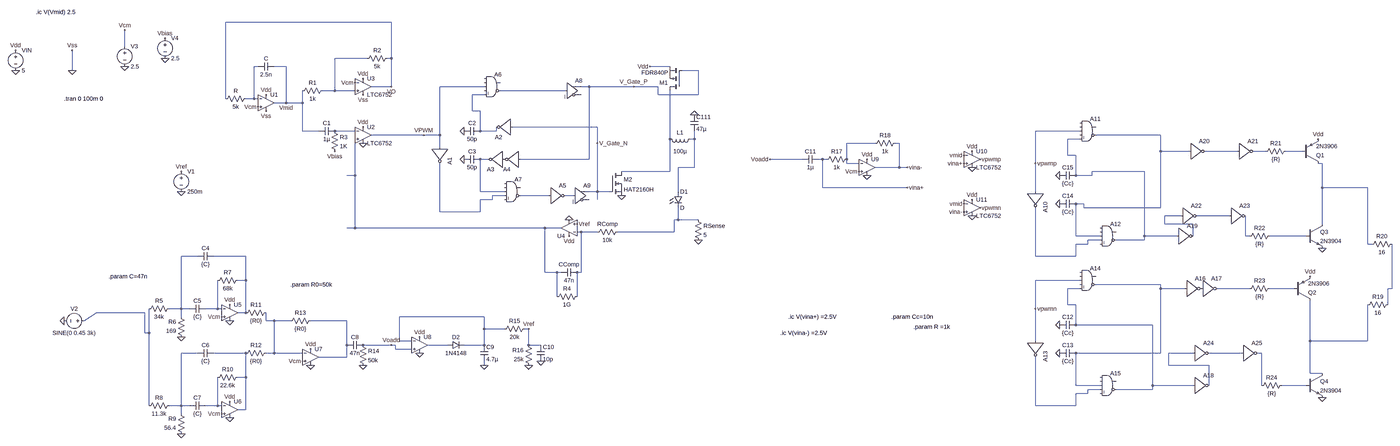
[diagram p0: schematic Final Ckt.asc, whole sheet]
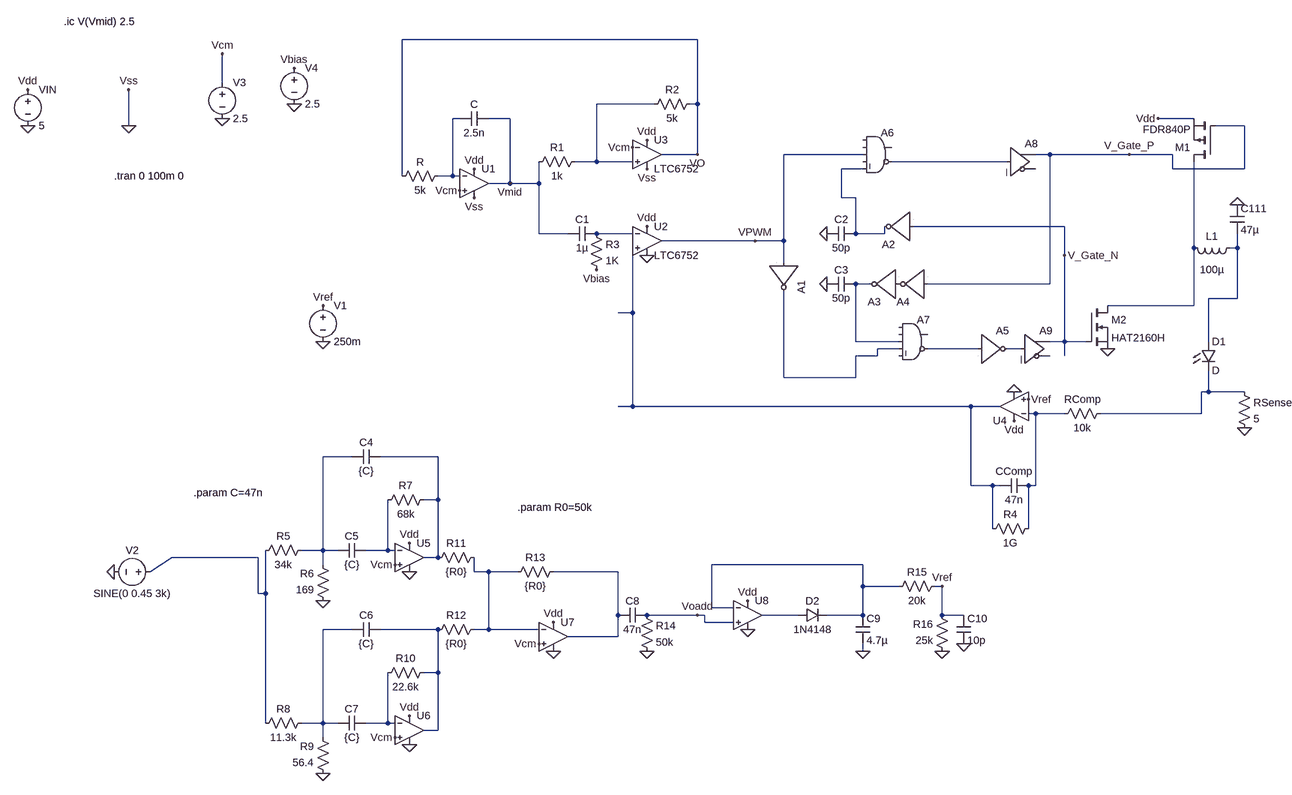
[diagram p1: schematic Final Ckt.asc, part, row 1 of 1, column 1 of 2]
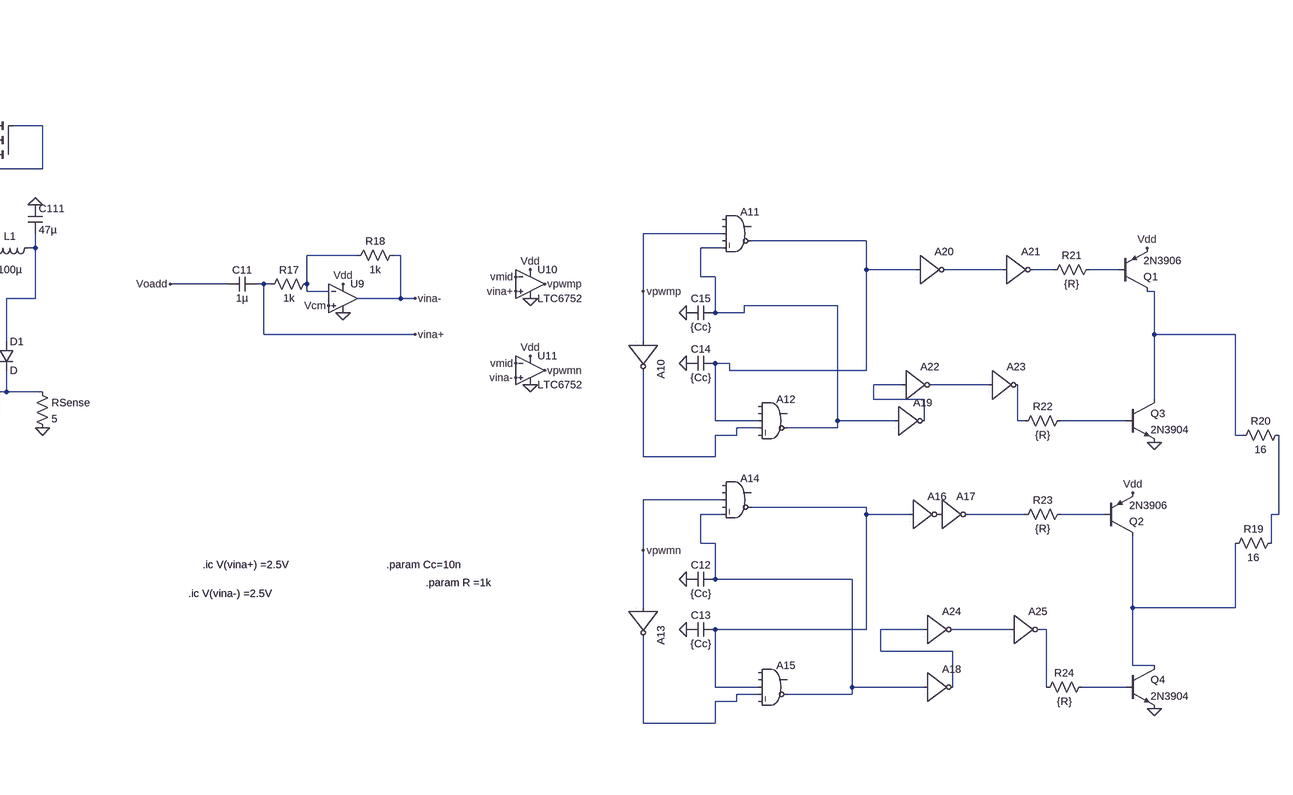
[diagram p2: schematic Final Ckt.asc, part, row 1 of 1, column 2 of 2]
Final Ckt.asc, the LTspice schematic file:
Version 4
SHEET 1 5192 1524
WIRE 624 -128 -32 -128
WIRE -432 -32 -432 -96
WIRE 528 16 400 16
WIRE 624 16 624 -128
WIRE 624 16 608 16
WIRE 96 48 80 48
WIRE 208 48 160 48
WIRE 1728 48 1648 48
WIRE -640 64 -640 -16
WIRE 1840 64 1776 64
WIRE 624 128 624 16
WIRE 624 128 544 128
WIRE 992 128 816 128
WIRE 1408 128 1376 128
WIRE 1584 128 1408 128
WIRE 1680 128 1584 128
WIRE 400 144 400 16
WIRE 400 144 352 144
WIRE 480 144 400 144
WIRE 1312 144 1056 144
WIRE 992 160 944 160
WIRE 1680 160 1680 128
WIRE 1840 160 1840 64
WIRE 1840 160 1680 160
WIRE -32 176 -32 -128
WIRE 80 176 80 48
WIRE 80 176 48 176
WIRE 96 176 80 176
WIRE 208 192 208 48
WIRE 208 192 160 192
WIRE 272 192 272 144
WIRE 272 192 208 192
WIRE 944 224 944 160
WIRE 976 224 944 224
WIRE 1440 288 1104 288
WIRE 272 304 272 192
WIRE 336 304 272 304
WIRE 480 304 400 304
WIRE 976 304 976 224
WIRE 1040 304 1040 288
WIRE 1040 304 976 304
WIRE 3936 304 3760 304
WIRE 752 320 544 320
WIRE 816 320 816 128
WIRE 816 320 752 320
WIRE 4256 320 4000 320
WIRE 1728 336 1728 144
WIRE 1824 336 1824 304
WIRE 1824 336 1808 336
WIRE 3936 336 3888 336
WIRE 1440 352 1440 288
WIRE 2960 352 2848 352
WIRE 3056 352 3040 352
WIRE 816 368 816 320
WIRE 4256 384 4256 320
WIRE 4368 384 4256 384
WIRE 4560 384 4432 384
WIRE 4672 384 4624 384
WIRE 4816 384 4752 384
WIRE 3888 400 3888 336
WIRE 3920 400 3888 400
WIRE 1008 416 976 416
WIRE 1408 416 1408 128
WIRE 1408 416 1136 416
WIRE 2672 416 2544 416
WIRE 2752 416 2736 416
WIRE 2768 416 2752 416
WIRE 2848 416 2848 352
WIRE 2848 432 2848 416
WIRE 2896 432 2848 432
WIRE 3760 432 3760 304
WIRE 4896 432 4880 432
WIRE 1824 448 1824 336
WIRE 1824 448 1760 448
WIRE 3056 448 3056 352
WIRE 3056 448 2960 448
WIRE 3088 448 3056 448
WIRE 1728 464 1728 336
WIRE 1728 464 1536 464
WIRE 4192 464 3984 464
WIRE 480 480 480 336
WIRE 480 480 448 480
WIRE 3920 480 3920 400
WIRE 3984 480 3984 464
WIRE 3984 480 3920 480
WIRE 2752 528 2752 416
WIRE 3088 528 2752 528
WIRE 4896 528 4896 432
WIRE 5088 528 4896 528
WIRE 976 544 976 416
WIRE 1072 544 976 544
WIRE 1440 544 1440 352
WIRE 1440 544 1408 544
WIRE 1488 544 1440 544
WIRE 1760 544 1760 448
WIRE 3760 544 3760 432
WIRE 1072 560 1024 560
WIRE 1248 560 1136 560
WIRE 1344 560 1312 560
WIRE 1024 576 1024 560
WIRE 1024 576 976 576
WIRE 1440 576 1440 544
WIRE 3952 592 3920 592
WIRE 3952 608 3952 592
WIRE 4256 608 4256 384
WIRE 4256 608 3952 608
WIRE 816 624 816 432
WIRE 976 624 976 576
WIRE 976 624 816 624
WIRE 4336 640 4272 640
WIRE 4528 640 4400 640
WIRE 1760 656 1760 608
WIRE 1760 656 1744 656
WIRE 1840 656 1760 656
WIRE 4272 672 4272 640
WIRE 4384 672 4272 672
WIRE 4896 672 4896 528
WIRE 480 688 480 480
WIRE 480 688 448 688
WIRE 1232 688 480 688
WIRE 1296 688 1232 688
WIRE 1376 704 1360 704
WIRE 1440 704 1376 704
WIRE 1744 704 1744 656
WIRE 1744 704 1520 704
WIRE 3920 720 3920 592
WIRE 4016 720 3920 720
WIRE 4192 720 4192 464
WIRE 4320 720 4192 720
WIRE 4384 720 4384 672
WIRE 4592 720 4592 640
WIRE 4608 720 4592 720
WIRE 4832 720 4688 720
WIRE 4016 736 3968 736
WIRE 4192 736 4192 720
WIRE 4192 736 4080 736
WIRE 3968 752 3968 736
WIRE 3968 752 3920 752
WIRE 5088 752 5088 528
WIRE 5104 752 5088 752
WIRE -144 800 -208 800
WIRE 48 800 -80 800
WIRE 3760 800 3760 608
WIRE 3920 800 3920 752
WIRE 3920 800 3760 800
WIRE 1232 864 1232 688
WIRE 1280 864 1232 864
WIRE 1296 864 1280 864
WIRE 1376 864 1376 704
WIRE 1376 864 1360 864
WIRE 48 896 48 800
WIRE 48 896 16 896
WIRE 3936 896 3760 896
WIRE 4256 912 4000 912
WIRE 3936 928 3888 928
WIRE 4256 928 4256 912
WIRE 4352 928 4256 928
WIRE 4608 928 4480 928
WIRE 4784 928 4688 928
WIRE 5184 928 5184 752
WIRE 5184 928 5168 928
WIRE 1280 960 1280 864
WIRE 1360 960 1360 864
WIRE 3888 992 3888 928
WIRE 3920 992 3888 992
WIRE 5168 992 5168 928
WIRE -208 1008 -208 800
WIRE -208 1008 -256 1008
WIRE -176 1008 -208 1008
WIRE -64 1008 -64 896
WIRE -64 1008 -112 1008
WIRE -48 1008 -64 1008
WIRE 3760 1008 3760 896
WIRE -352 1024 -544 1024
WIRE 48 1024 48 896
WIRE 48 1024 16 1024
WIRE -208 1040 -208 1008
WIRE 992 1040 656 1040
WIRE -592 1056 -544 1024
WIRE 128 1056 128 1024
WIRE 160 1056 128 1056
WIRE 224 1056 160 1056
WIRE 448 1056 304 1056
WIRE 3920 1072 3920 992
WIRE 4224 1072 3920 1072
WIRE 992 1088 992 1040
WIRE 1072 1088 992 1088
WIRE 1168 1088 1152 1088
WIRE -352 1104 -352 1024
WIRE -336 1104 -336 1008
WIRE -336 1104 -352 1104
WIRE 656 1136 656 1040
WIRE 704 1136 656 1136
WIRE 3760 1136 3760 1008
WIRE 4848 1136 4848 976
WIRE 5088 1136 5088 992
WIRE 5088 1136 4848 1136
WIRE 448 1152 448 1056
WIRE 624 1152 512 1152
WIRE 640 1152 624 1152
WIRE 848 1152 768 1152
WIRE 992 1152 992 1088
WIRE 992 1152 912 1152
WIRE 1168 1152 1168 1088
WIRE 1216 1152 1168 1152
WIRE 640 1168 640 1152
WIRE 704 1168 640 1168
WIRE -144 1184 -208 1184
WIRE 48 1184 -80 1184
WIRE 160 1184 160 1056
WIRE 160 1184 128 1184
WIRE 272 1184 160 1184
WIRE 4256 1184 4256 928
WIRE 4256 1184 3920 1184
WIRE 4384 1184 4288 1184
WIRE 4576 1184 4448 1184
WIRE 4656 1184 4640 1184
WIRE 448 1200 448 1152
WIRE 448 1200 336 1200
WIRE 992 1232 992 1216
WIRE 4288 1232 4288 1184
WIRE 4448 1232 4288 1232
WIRE 4848 1264 4848 1136
WIRE 4896 1264 4848 1264
WIRE 48 1280 48 1184
WIRE 48 1280 16 1280
WIRE 3920 1312 3920 1184
WIRE 4016 1312 3920 1312
WIRE 4224 1312 4224 1072
WIRE 4384 1312 4224 1312
WIRE 4448 1312 4448 1232
WIRE 4656 1312 4656 1184
WIRE 4832 1312 4736 1312
WIRE 4016 1328 3968 1328
WIRE 4224 1328 4224 1312
WIRE 4224 1328 4080 1328
WIRE 3968 1344 3968 1328
WIRE 3968 1344 3920 1344
WIRE -336 1392 -336 1104
WIRE -208 1392 -208 1184
WIRE -208 1392 -256 1392
WIRE -176 1392 -208 1392
WIRE -64 1392 -64 1280
WIRE -64 1392 -112 1392
WIRE -48 1392 -64 1392
WIRE 3760 1392 3760 1200
WIRE 3920 1392 3920 1344
WIRE 3920 1392 3760 1392
WIRE 48 1408 48 1280
WIRE 48 1408 16 1408
WIRE -208 1424 -208 1392
FLAG 128 224 Vss
FLAG 512 160 Vss
FLAG -640 -16 Vss
FLAG 96 208 Vcm
FLAG 480 112 Vcm
FLAG -640 64 0
FLAG -864 64 0
FLAG 624 128 VO
FLAG 208 192 Vmid
FLAG 512 96 Vdd
FLAG 128 160 Vdd
FLAG -864 -16 Vdd
FLAG -432 -96 Vcm
FLAG -432 48 0
FLAG 400 384 Vbias
FLAG -272 -64 Vbias
FLAG -272 16 0
FLAG 512 288 Vdd
FLAG 512 352 0
FLAG 752 320 VPWM
FLAG 912 304 0
FLAG 912 416 0
FLAG 1536 560 0
FLAG 1648 48 Vdd
FLAG 1440 352 V_Gate_N
FLAG 1584 128 V_Gate_P
FLAG 1824 240 0
FLAG 1840 736 0
FLAG 1328 656 0
FLAG 1328 720 Vdd
FLAG 1360 672 Vref
FLAG -208 1120 0
FLAG -16 1056 0
FLAG -48 1040 Vcm
FLAG -16 992 Vdd
FLAG -208 1504 0
FLAG -16 1440 0
FLAG -48 1424 Vcm
FLAG -16 1376 Vdd
FLAG -672 1056 0
FLAG 304 1168 Vdd
FLAG 304 1232 0
FLAG 272 1216 Vcm
FLAG 512 1232 0
FLAG 736 1120 Vdd
FLAG 736 1184 0
FLAG 992 1232 0
FLAG 1216 1216 0
FLAG 1168 1232 0
FLAG 2896 464 Vcm
FLAG 3088 448 vina-
FLAG 3088 528 vina+
FLAG 2928 416 Vdd
FLAG 2928 480 0
FLAG 3344 384 Vdd
FLAG 3344 576 Vdd
FLAG 3344 448 0
FLAG 3344 640 0
FLAG 3312 400 vmid
FLAG 3312 592 vmid
FLAG 3312 624 vina-
FLAG 3312 432 vina+
FLAG 3376 416 vpwmp
FLAG 3376 608 vpwmn
FLAG 3856 480 0
FLAG 3856 592 0
FLAG 3856 1072 0
FLAG 3856 1184 0
FLAG 3760 432 vpwmp
FLAG 3760 1008 vpwmn
FLAG 4848 880 Vdd
FLAG 4880 336 Vdd
FLAG 4896 768 0
FLAG 4896 1360 0
FLAG -208 464 Vref
FLAG -208 544 0
FLAG 1168 1088 Vref
FLAG 2544 416 Voadd
FLAG 624 1152 Voadd
DATAFLAG 432 304 ""
DATAFLAG 272 192 ""
SYMBOL Opamps\\UniversalOpamp2 128 192 R0
SYMATTR InstName U1
SYMBOL res 64 160 R90
WINDOW 0 0 56 VBottom 2
WINDOW 3 32 56 VTop 2
SYMATTR InstName R
SYMATTR Value 5k
SYMBOL res 368 128 R90
WINDOW 0 0 56 VBottom 2
WINDOW 3 32 56 VTop 2
SYMATTR InstName R1
SYMATTR Value 1k
SYMBOL res 624 0 R90
WINDOW 0 0 56 VBottom 2
WINDOW 3 32 56 VTop 2
SYMATTR InstName R2
SYMATTR Value 5k
SYMBOL cap 160 32 R90
WINDOW 0 0 32 VBottom 2
WINDOW 3 32 32 VTop 2
SYMATTR InstName C
SYMATTR Value 2.5n
SYMBOL voltage -864 -32 R0
WINDOW 123 0 0 Left 0
WINDOW 39 0 0 Left 0
SYMATTR InstName VIN
SYMATTR Value 5
SYMBOL voltage -432 -48 R0
WINDOW 123 0 0 Left 0
WINDOW 39 0 0 Left 0
SYMATTR InstName V3
SYMATTR Value 2.5
SYMBOL Comparators\\LTC6752 512 64 R0
SYMATTR InstName U3
SYMBOL cap 400 288 R90
WINDOW 0 0 32 VBottom 2
WINDOW 3 32 32 VTop 2
SYMATTR InstName C1
SYMATTR Value 1µ
SYMBOL res 384 288 R0
SYMATTR InstName R3
SYMATTR Value 1K
SYMBOL voltage -272 -80 R0
WINDOW 123 0 0 Left 0
WINDOW 39 0 0 Left 0
SYMATTR InstName V4
SYMATTR Value 2.5
SYMBOL Comparators\\LTC6752 512 256 R0
SYMATTR InstName U2
SYMBOL cap 976 288 R90
WINDOW 0 0 32 VBottom 2
WINDOW 3 32 32 VTop 2
SYMATTR InstName C2
SYMATTR Value 50p
SYMBOL cap 976 400 R90
WINDOW 0 0 32 VBottom 2
WINDOW 3 32 32 VTop 2
SYMATTR InstName C3
SYMATTR Value 50p
SYMBOL Digital\\inv 880 368 R90
WINDOW 3 0 0 Invisible 0
SYMATTR Value Vhigh=5 Vlow=0
SYMATTR InstName A1
SYMATTR Value2 Trise=5n Tfall=5n Td=5n
SYMBOL Digital\\and 1024 64 R0
WINDOW 3 -35 -179 Invisible 2
SYMATTR Value Vhigh=5 Vlow=0
SYMATTR InstName A6
SYMATTR Value2 Trise=50n Tfall=50n Td=50n
SYMBOL Digital\\and 1104 480 R0
WINDOW 3 -4 207 Invisible 2
SYMATTR Value Vhigh=5 Vlow=0
SYMATTR InstName A7
SYMATTR Value2 Trise=50n Tfall=50n Td=50n
SYMBOL Digital\\buf 1312 80 R0
WINDOW 3 5 -233 Invisible 2
SYMATTR Value Vhigh=5 Vlow=0
SYMATTR InstName A8
SYMATTR Value2 Trise=50n Tfall=50n Td=50n
SYMBOL Digital\\buf 1344 496 R0
WINDOW 3 84 202 Invisible 2
SYMATTR Value Vhigh=5 Vlow=0
SYMATTR InstName A9
SYMATTR Value2 Trise=50n Tfall=50n Td=50n
SYMBOL pmos 1776 144 R180
SYMATTR InstName M1
SYMATTR Value FDR840P
SYMBOL nmos 1488 464 R0
SYMATTR InstName M2
SYMATTR Value HAT2160H
SYMBOL ind 1824 320 R90
WINDOW 0 5 56 VBottom 2
WINDOW 3 48 56 VTop 2
SYMATTR InstName L1
SYMATTR Value 100µ
SYMBOL cap 1808 240 R0
SYMATTR InstName C111
SYMATTR Value 47µ
SYMBOL Digital\\inv 1104 352 R180
WINDOW 3 0 0 Invisible 0
SYMATTR Value Vhigh=5 Vlow=0
SYMATTR InstName A2
SYMATTR Value2 Trise=50n Tfall=50n Td=50n
SYMBOL Digital\\inv 1072 480 R180
WINDOW 3 0 0 Invisible 0
SYMATTR Value Vhigh=5 Vlow=0
SYMATTR InstName A3
SYMATTR Value2 Trise=50n Tfall=50n Td=50n
SYMBOL Digital\\inv 1136 480 R180
WINDOW 3 0 0 Invisible 0
SYMATTR Value Vhigh=5 Vlow=0
SYMATTR InstName A4
SYMATTR Value2 Trise=50n Tfall=50n Td=50n
SYMBOL Digital\\inv 1248 496 R0
WINDOW 3 0 0 Invisible 0
SYMATTR Value Vhigh=5 Vlow=0
SYMATTR InstName A5
SYMATTR Value2 Trise=50n Tfall=50n Td=50n
SYMBOL res 1824 640 R0
SYMATTR InstName RSense
SYMATTR Value 5
SYMBOL res 1536 688 R90
WINDOW 0 0 56 VBottom 2
WINDOW 3 32 56 VTop 2
SYMATTR InstName RComp
SYMATTR Value 10k
SYMBOL cap 1360 848 R90
WINDOW 0 0 32 VBottom 2
WINDOW 3 32 32 VTop 2
SYMATTR InstName CComp
SYMATTR Value 47n
SYMBOL Opamps\\UniversalOpamp2 1328 688 R180
SYMATTR InstName U4
SYMBOL LED 1744 544 R0
SYMATTR InstName D1
SYMBOL res 1376 944 R90
WINDOW 0 0 56 VBottom 2
WINDOW 3 32 56 VTop 2
SYMATTR InstName R4
SYMATTR Value 1G
SYMBOL res -240 992 R90
WINDOW 0 0 56 VBottom 2
WINDOW 3 32 56 VTop 2
SYMATTR InstName R5
SYMATTR Value 34k
SYMBOL res -192 1136 R180
WINDOW 0 36 76 Left 2
WINDOW 3 36 40 Left 2
SYMATTR InstName R6
SYMATTR Value 169
SYMBOL res -80 912 R270
WINDOW 0 32 56 VTop 2
WINDOW 3 0 56 VBottom 2
SYMATTR InstName R7
SYMATTR Value 68k
SYMBOL cap -80 784 R90
WINDOW 0 0 32 VBottom 2
WINDOW 3 32 32 VTop 2
SYMATTR InstName C4
SYMATTR Value {C}
SYMBOL Opamps\\UniversalOpamp2 -16 1024 R0
SYMATTR InstName U5
SYMBOL res -240 1376 R90
WINDOW 0 0 56 VBottom 2
WINDOW 3 32 56 VTop 2
SYMATTR InstName R8
SYMATTR Value 11.3k
SYMBOL res -192 1520 R180
WINDOW 0 36 76 Left 2
WINDOW 3 36 40 Left 2
SYMATTR InstName R9
SYMATTR Value 56.4
SYMBOL res -80 1296 R270
WINDOW 0 32 56 VTop 2
WINDOW 3 0 56 VBottom 2
SYMATTR InstName R10
SYMATTR Value 22.6k
SYMBOL Opamps\\UniversalOpamp2 -16 1408 R0
SYMATTR InstName U6
SYMBOL cap -112 992 R90
WINDOW 0 0 32 VBottom 2
WINDOW 3 32 32 VTop 2
SYMATTR InstName C5
SYMATTR Value {C}
SYMBOL cap -80 1168 R90
WINDOW 0 0 32 VBottom 2
WINDOW 3 32 32 VTop 2
SYMATTR InstName C6
SYMATTR Value {C}
SYMBOL cap -112 1376 R90
WINDOW 0 0 32 VBottom 2
WINDOW 3 32 32 VTop 2
SYMATTR InstName C7
SYMATTR Value {C}
SYMBOL voltage -576 1056 R90
WINDOW 0 -32 56 VBottom 2
WINDOW 3 32 56 VTop 2
WINDOW 123 0 0 Left 0
WINDOW 39 0 0 Left 0
SYMATTR InstName V2
SYMATTR Value SINE(0 0.45 3k)
SYMBOL res 144 1008 R90
WINDOW 0 0 56 VBottom 2
WINDOW 3 32 56 VTop 2
SYMATTR InstName R11
SYMATTR Value {R0}
SYMBOL res 144 1168 R90
WINDOW 0 0 56 VBottom 2
WINDOW 3 32 56 VTop 2
SYMATTR InstName R12
SYMATTR Value {R0}
SYMBOL res 320 1040 R90
WINDOW 0 0 56 VBottom 2
WINDOW 3 32 56 VTop 2
SYMATTR InstName R13
SYMATTR Value {R0}
SYMBOL Opamps\\UniversalOpamp2 304 1200 R0
SYMATTR InstName U7
SYMBOL res 496 1136 R0
SYMATTR InstName R14
SYMATTR Value 50k
SYMBOL cap 512 1136 R90
WINDOW 0 0 32 VBottom 2
WINDOW 3 32 32 VTop 2
SYMATTR InstName C8
SYMATTR Value 47n
SYMBOL diode 848 1168 R270
WINDOW 0 32 32 VTop 2
WINDOW 3 0 32 VBottom 2
SYMATTR InstName D2
SYMATTR Value 1N4148
SYMBOL Opamps\\UniversalOpamp2 736 1152 R0
SYMATTR InstName U8
SYMBOL cap 976 1152 R0
SYMATTR InstName C9
SYMATTR Value 4.7µ
SYMBOL res 1168 1072 R90
WINDOW 0 0 56 VBottom 2
WINDOW 3 32 56 VTop 2
SYMATTR InstName R15
SYMATTR Value 20k
SYMBOL res 1184 1248 R180
WINDOW 0 36 76 Left 2
WINDOW 3 36 40 Left 2
SYMATTR InstName R16
SYMATTR Value 25k
SYMBOL cap 1200 1152 R0
SYMATTR InstName C10
SYMATTR Value 10p
SYMBOL cap 2736 400 R90
WINDOW 0 0 32 VBottom 2
WINDOW 3 32 32 VTop 2
SYMATTR InstName C11
SYMATTR Value 1µ
SYMBOL res 2864 400 R90
WINDOW 0 0 56 VBottom 2
WINDOW 3 32 56 VTop 2
SYMATTR InstName R17
SYMATTR Value 1k
SYMBOL res 3056 336 R90
WINDOW 0 0 56 VBottom 2
WINDOW 3 32 56 VTop 2
SYMATTR InstName R18
SYMATTR Value 1k
SYMBOL Opamps\\UniversalOpamp2 2928 448 R0
SYMATTR InstName U9
SYMBOL Comparators\\LTC6752 3344 352 R0
SYMATTR InstName U10
SYMBOL Comparators\\LTC6752 3344 544 R0
SYMATTR InstName U11
SYMBOL Digital\\inv 3824 544 R90
WINDOW 3 0 0 Invisible 0
SYMATTR Value Vhigh=5 Vlow=0
SYMATTR InstName A10
SYMATTR Value2 Trise=5n Tfall=5n Td=5n
SYMBOL Digital\\and 3968 240 R0
WINDOW 3 -35 -179 Invisible 2
SYMATTR Value Vhigh=5 Vlow=0
SYMATTR InstName A11
SYMATTR Value2 Trise=50n Tfall=50n Td=50n
SYMBOL Digital\\and 4048 656 R0
WINDOW 3 -4 207 Invisible 2
SYMATTR Value Vhigh=5 Vlow=0
SYMATTR InstName A12
SYMATTR Value2 Trise=50n Tfall=50n Td=50n
SYMBOL cap 3920 1056 R90
WINDOW 0 0 32 VBottom 2
WINDOW 3 32 32 VTop 2
SYMATTR InstName C12
SYMATTR Value {Cc}
SYMBOL Digital\\inv 3824 1136 R90
WINDOW 3 0 0 Invisible 0
SYMATTR Value Vhigh=5 Vlow=0
SYMATTR InstName A13
SYMATTR Value2 Trise=5n Tfall=5n Td=5n
SYMBOL Digital\\and 3968 832 R0
WINDOW 3 -35 -179 Invisible 2
SYMATTR Value Vhigh=5 Vlow=0
SYMATTR InstName A14
SYMATTR Value2 Trise=50n Tfall=50n Td=50n
SYMBOL Digital\\and 4048 1248 R0
WINDOW 3 -4 207 Invisible 2
SYMATTR Value Vhigh=5 Vlow=0
SYMATTR InstName A15
SYMATTR Value2 Trise=50n Tfall=50n Td=50n
SYMBOL pnp 4816 432 M180
SYMATTR InstName Q1
SYMATTR Value 2N3906
SYMBOL pnp 4784 976 M180
SYMATTR InstName Q2
SYMATTR Value 2N3906
SYMBOL npn 4832 672 R0
SYMATTR InstName Q3
SYMATTR Value 2N3904
SYMBOL npn 4832 1264 R0
SYMATTR InstName Q4
SYMATTR Value 2N3904
SYMBOL res 5184 976 R90
WINDOW 0 0 56 VBottom 2
WINDOW 3 32 56 VTop 2
SYMATTR InstName R19
SYMATTR Value 16
SYMBOL res 5200 736 R90
WINDOW 0 0 56 VBottom 2
WINDOW 3 32 56 VTop 2
SYMATTR InstName R20
SYMATTR Value 16
SYMBOL Digital\\inv 4352 864 R0
WINDOW 3 0 0 Invisible 0
SYMATTR Value Vhigh=5 Vlow=0
SYMATTR InstName A16
SYMATTR Value2 Trise=5n Tfall=5n Td=5n
SYMBOL Digital\\inv 4416 864 R0
WINDOW 3 0 0 Invisible 0
SYMATTR Value Vhigh=5 Vlow=0
SYMATTR InstName A17
SYMATTR Value2 Trise=5n Tfall=5n Td=5n
SYMBOL Digital\\inv 4384 1248 R0
WINDOW 3 0 0 Invisible 0
SYMATTR Value Vhigh=5 Vlow=0
SYMATTR InstName A18
SYMATTR Value2 Trise=5n Tfall=5n Td=5n
SYMBOL Digital\\inv 4320 656 R0
WINDOW 3 0 0 Invisible 0
SYMATTR Value Vhigh=5 Vlow=0
SYMATTR InstName A19
SYMATTR Value2 Trise=5n Tfall=5n Td=5n
SYMBOL Digital\\inv 4368 320 R0
WINDOW 3 0 0 Invisible 0
SYMATTR Value Vhigh=5 Vlow=0
SYMATTR InstName A20
SYMATTR Value2 Trise=5n Tfall=5n Td=5n
SYMBOL Digital\\inv 4560 320 R0
WINDOW 3 0 0 Invisible 0
SYMATTR Value Vhigh=5 Vlow=0
SYMATTR InstName A21
SYMATTR Value2 Trise=5n Tfall=5n Td=5n
SYMBOL cap 3920 1168 R90
WINDOW 0 0 32 VBottom 2
WINDOW 3 32 32 VTop 2
SYMATTR InstName C13
SYMATTR Value {Cc}
SYMBOL cap 3920 576 R90
WINDOW 0 0 32 VBottom 2
WINDOW 3 32 32 VTop 2
SYMATTR InstName C14
SYMATTR Value {Cc}
SYMBOL cap 3920 464 R90
WINDOW 0 0 32 VBottom 2
WINDOW 3 32 32 VTop 2
SYMATTR InstName C15
SYMATTR Value {Cc}
SYMBOL res 4768 368 R90
WINDOW 0 0 56 VBottom 2
WINDOW 3 32 56 VTop 2
SYMATTR InstName R21
SYMATTR Value {R}
SYMBOL res 4704 704 R90
WINDOW 0 0 56 VBottom 2
WINDOW 3 32 56 VTop 2
SYMATTR InstName R22
SYMATTR Value {R}
SYMBOL res 4704 912 R90
WINDOW 0 0 56 VBottom 2
WINDOW 3 32 56 VTop 2
SYMATTR InstName R23
SYMATTR Value {R}
SYMBOL res 4752 1296 R90
WINDOW 0 0 56 VBottom 2
WINDOW 3 32 56 VTop 2
SYMATTR InstName R24
SYMATTR Value {R}
SYMBOL Digital\\inv 4336 576 R0
WINDOW 3 0 0 Invisible 0
SYMATTR Value Vhigh=5 Vlow=0
SYMATTR InstName A22
SYMATTR Value2 Trise=5n Tfall=5n Td=5n
SYMBOL Digital\\inv 4528 576 R0
WINDOW 3 0 0 Invisible 0
SYMATTR Value Vhigh=5 Vlow=0
SYMATTR InstName A23
SYMATTR Value2 Trise=5n Tfall=5n Td=5n
SYMBOL Digital\\inv 4384 1120 R0
WINDOW 3 0 0 Invisible 0
SYMATTR Value Vhigh=5 Vlow=0
SYMATTR InstName A24
SYMATTR Value2 Trise=5n Tfall=5n Td=5n
SYMBOL Digital\\inv 4576 1120 R0
WINDOW 3 0 0 Invisible 0
SYMATTR Value Vhigh=5 Vlow=0
SYMATTR InstName A25
SYMATTR Value2 Trise=5n Tfall=5n Td=5n
SYMBOL voltage -208 448 R0
WINDOW 123 0 0 Left 0
WINDOW 39 0 0 Left 0
SYMATTR InstName V1
SYMATTR Value 250m
TEXT -672 176 Left 2 !.tran 0 100m 0
TEXT -784 -168 Left 2 !.ic V(Vmid) 2.5
TEXT -496 880 Left 2 !.param C=47n
TEXT 224 912 Left 2 !.param R0=50k
TEXT 2584 1104 Left 2 !.ic V(vina-) =2.5V
TEXT 2616 1040 Left 2 !.ic V(vina+) =2.5V
TEXT 3024 1040 Left 2 !.param Cc=10n
TEXT 3112 1080 Left 2 !.param R =1k

The netlist it stands for:
* Final Ckt.asc
XU1 Vcm N002 Vdd 0 Vmid level.2 Avol=1Meg GBW=10Meg Slew=10Meg ilimit=25m rail=0 Vos=0 phimargin=45 en=0 enk=0 in=0 ink=0 Rin=500Meg  ; pins IN+ IN- V+ V- OUT
R N002 VO 5k
R1 N001 Vmid 1k
R2 VO N001 5k
C Vmid N002 2.5n
VIN Vdd 0 5
V3 Vcm 0 2.5
XU3 N001 Vcm Vdd 0 VO LTC6752  ; pins In+ In- V+ V- OUT
C1 N005 Vmid 1µ
R3 N005 Vbias 1K
V4 Vbias 0 2.5
XU2 N016 N005 Vdd 0 VPWM LTC6752  ; pins In+ In- V+ V- OUT
C2 N004 0 50p
C3 N014 0 50p
A1 VPWM 0 0 0 0 N017 0 0 BUF Vhigh=5 Vlow=0 Trise=5n Tfall=5n Td=5n
A6 0 0 VPWM 0 N004 N003 0 0 AND Vhigh=5 Vlow=0 Trise=50n Tfall=50n Td=50n
A7 0 0 N014 N017 0 N018 0 0 AND Vhigh=5 Vlow=0 Trise=50n Tfall=50n Td=50n
A8 N003 0 0 0 0 0 V_Gate_P 0 BUF Vhigh=5 Vlow=0 Trise=50n Tfall=50n Td=50n
A9 N019 0 0 0 0 0 V_Gate_N 0 BUF Vhigh=5 Vlow=0 Trise=50n Tfall=50n Td=50n
M1 N007 V_Gate_P Vdd Vdd FDR840P
M2 N007 V_Gate_N 0 0 HAT2160H
L1 N008 N007 100µ
C111 0 N008 47µ
A2 V_Gate_N 0 0 0 0 N004 0 0 BUF Vhigh=5 Vlow=0 Trise=50n Tfall=50n Td=50n
A3 P001 0 0 0 0 N014 0 0 BUF Vhigh=5 Vlow=0 Trise=50n Tfall=50n Td=50n
A4 V_Gate_P 0 0 0 0 P001 0 0 BUF Vhigh=5 Vlow=0 Trise=50n Tfall=50n Td=50n
A5 N018 0 0 0 0 N019 0 0 BUF Vhigh=5 Vlow=0 Trise=50n Tfall=50n Td=50n
RSense N022 0 5
RComp N022 N023 10k
CComp N023 N016 47n
XU4 Vref N023 Vdd 0 N016 level.2 Avol=1Meg GBW=10Meg Slew=10Meg ilimit=25m rail=0 Vos=0 phimargin=45 en=0 enk=0 in=0 ink=0 Rin=500Meg  ; pins IN+ IN- V+ V- OUT
D1 N008 N022 D
R4 N023 N016 1G
R5 N027 N035 34k
R6 0 N027 169
R7 N034 N028 68k
C4 N028 N027 {C}
XU5 Vcm N034 Vdd 0 N028 level.2 Avol=1Meg GBW=10Meg Slew=10Meg ilimit=25m rail=0 Vos=0 phimargin=45 en=0 enk=0 in=0 ink=0 Rin=500Meg  ; pins IN+ IN- V+ V- OUT
R8 N041 N035 11.3k
R9 0 N041 56.4
R10 N048 N042 22.6k
XU6 Vcm N048 Vdd 0 N042 level.2 Avol=1Meg GBW=10Meg Slew=10Meg ilimit=25m rail=0 Vos=0 phimargin=45 en=0 enk=0 in=0 ink=0 Rin=500Meg  ; pins IN+ IN- V+ V- OUT
C5 N034 N027 {C}
C6 N042 N041 {C}
C7 N048 N041 {C}
V2 N035 0 SINE(0 0.45 3k)
R11 N037 N028 {R0}
R12 N037 N042 {R0}
R13 N038 N037 {R0}
XU7 Vcm N037 Vdd 0 N038 level.2 Avol=1Meg GBW=10Meg Slew=10Meg ilimit=25m rail=0 Vos=0 phimargin=45 en=0 enk=0 in=0 ink=0 Rin=500Meg  ; pins IN+ IN- V+ V- OUT
R14 Voadd 0 50k
C8 Voadd N038 47n
D2 N040 N036 1N4148
XU8 Voadd N036 Vdd 0 N040 level.2 Avol=1Meg GBW=10Meg Slew=10Meg ilimit=25m rail=0 Vos=0 phimargin=45 en=0 enk=0 in=0 ink=0 Rin=500Meg  ; pins IN+ IN- V+ V- OUT
C9 N036 0 4.7µ
R15 Vref N036 20k
R16 0 Vref 25k
C10 Vref 0 10p
C11 vina+ Voadd 1µ
R17 N010 vina+ 1k
R18 vina- N010 1k
XU9 Vcm N010 Vdd 0 vina- level.2 Avol=1Meg GBW=10Meg Slew=10Meg ilimit=25m rail=0 Vos=0 phimargin=45 en=0 enk=0 in=0 ink=0 Rin=500Meg  ; pins IN+ IN- V+ V- OUT
XU10 vina+ Vmid Vdd 0 vpwmp LTC6752  ; pins In+ In- V+ V- OUT
XU11 vina- Vmid Vdd 0 vpwmn LTC6752  ; pins In+ In- V+ V- OUT
A10 vpwmp 0 0 0 0 N026 0 0 BUF Vhigh=5 Vlow=0 Trise=5n Tfall=5n Td=5n
A11 0 0 vpwmp 0 N009 N006 0 0 AND Vhigh=5 Vlow=0 Trise=50n Tfall=50n Td=50n
A12 0 0 N006 N026 0 N009 0 0 AND Vhigh=5 Vlow=0 Trise=50n Tfall=50n Td=50n
C12 N030 0 {Cc}
A13 vpwmn 0 0 0 0 N047 0 0 BUF Vhigh=5 Vlow=0 Trise=5n Tfall=5n Td=5n
A14 0 0 vpwmn 0 N030 N029 0 0 AND Vhigh=5 Vlow=0 Trise=50n Tfall=50n Td=50n
A15 0 0 N029 N047 0 N030 0 0 AND Vhigh=5 Vlow=0 Trise=50n Tfall=50n Td=50n
Q1 N015 N013 Vdd 0 2N3906
Q2 N039 N032 Vdd 0 2N3906
Q3 N015 N025 0 0 2N3904
Q4 N039 N046 0 0 2N3904
R19 N033 N039 16
R20 N033 N015 16
A16 N029 0 0 0 0 P002 0 0 BUF Vhigh=5 Vlow=0 Trise=5n Tfall=5n Td=5n
A17 P002 0 0 0 0 N031 0 0 BUF Vhigh=5 Vlow=0 Trise=5n Tfall=5n Td=5n
A18 N030 0 0 0 0 N043 0 0 BUF Vhigh=5 Vlow=0 Trise=5n Tfall=5n Td=5n
A19 N009 0 0 0 0 N020 0 0 BUF Vhigh=5 Vlow=0 Trise=5n Tfall=5n Td=5n
A20 N006 0 0 0 0 N011 0 0 BUF Vhigh=5 Vlow=0 Trise=5n Tfall=5n Td=5n
A21 N011 0 0 0 0 N012 0 0 BUF Vhigh=5 Vlow=0 Trise=5n Tfall=5n Td=5n
C13 N029 0 {Cc}
C14 N006 0 {Cc}
C15 N009 0 {Cc}
R21 N013 N012 {R}
R22 N025 N024 {R}
R23 N032 N031 {R}
R24 N046 N045 {R}
A22 N020 0 0 0 0 N021 0 0 BUF Vhigh=5 Vlow=0 Trise=5n Tfall=5n Td=5n
A23 N021 0 0 0 0 N024 0 0 BUF Vhigh=5 Vlow=0 Trise=5n Tfall=5n Td=5n
A24 N043 0 0 0 0 N044 0 0 BUF Vhigh=5 Vlow=0 Trise=5n Tfall=5n Td=5n
A25 N044 0 0 0 0 N045 0 0 BUF Vhigh=5 Vlow=0 Trise=5n Tfall=5n Td=5n
V1 Vref 0 250m
.model D D
.lib standard.dio
.model NPN NPN
.model PNP PNP
.lib standard.bjt
.model NMOS NMOS
.model PMOS PMOS
.lib standard.mos
.tran 0 100m 0
.ic V(Vmid) 2.5
.param C=47n
.param R0=50k
.ic V(vina-) =2.5V
.ic V(vina+) =2.5V
.param Cc=10n
.param R =1k
.lib UniversalOpamps2.sub
.lib LTC7.lib
.backanno
.end